# EAGLE design LMD18200_24 (EAGLE 7.7.0)
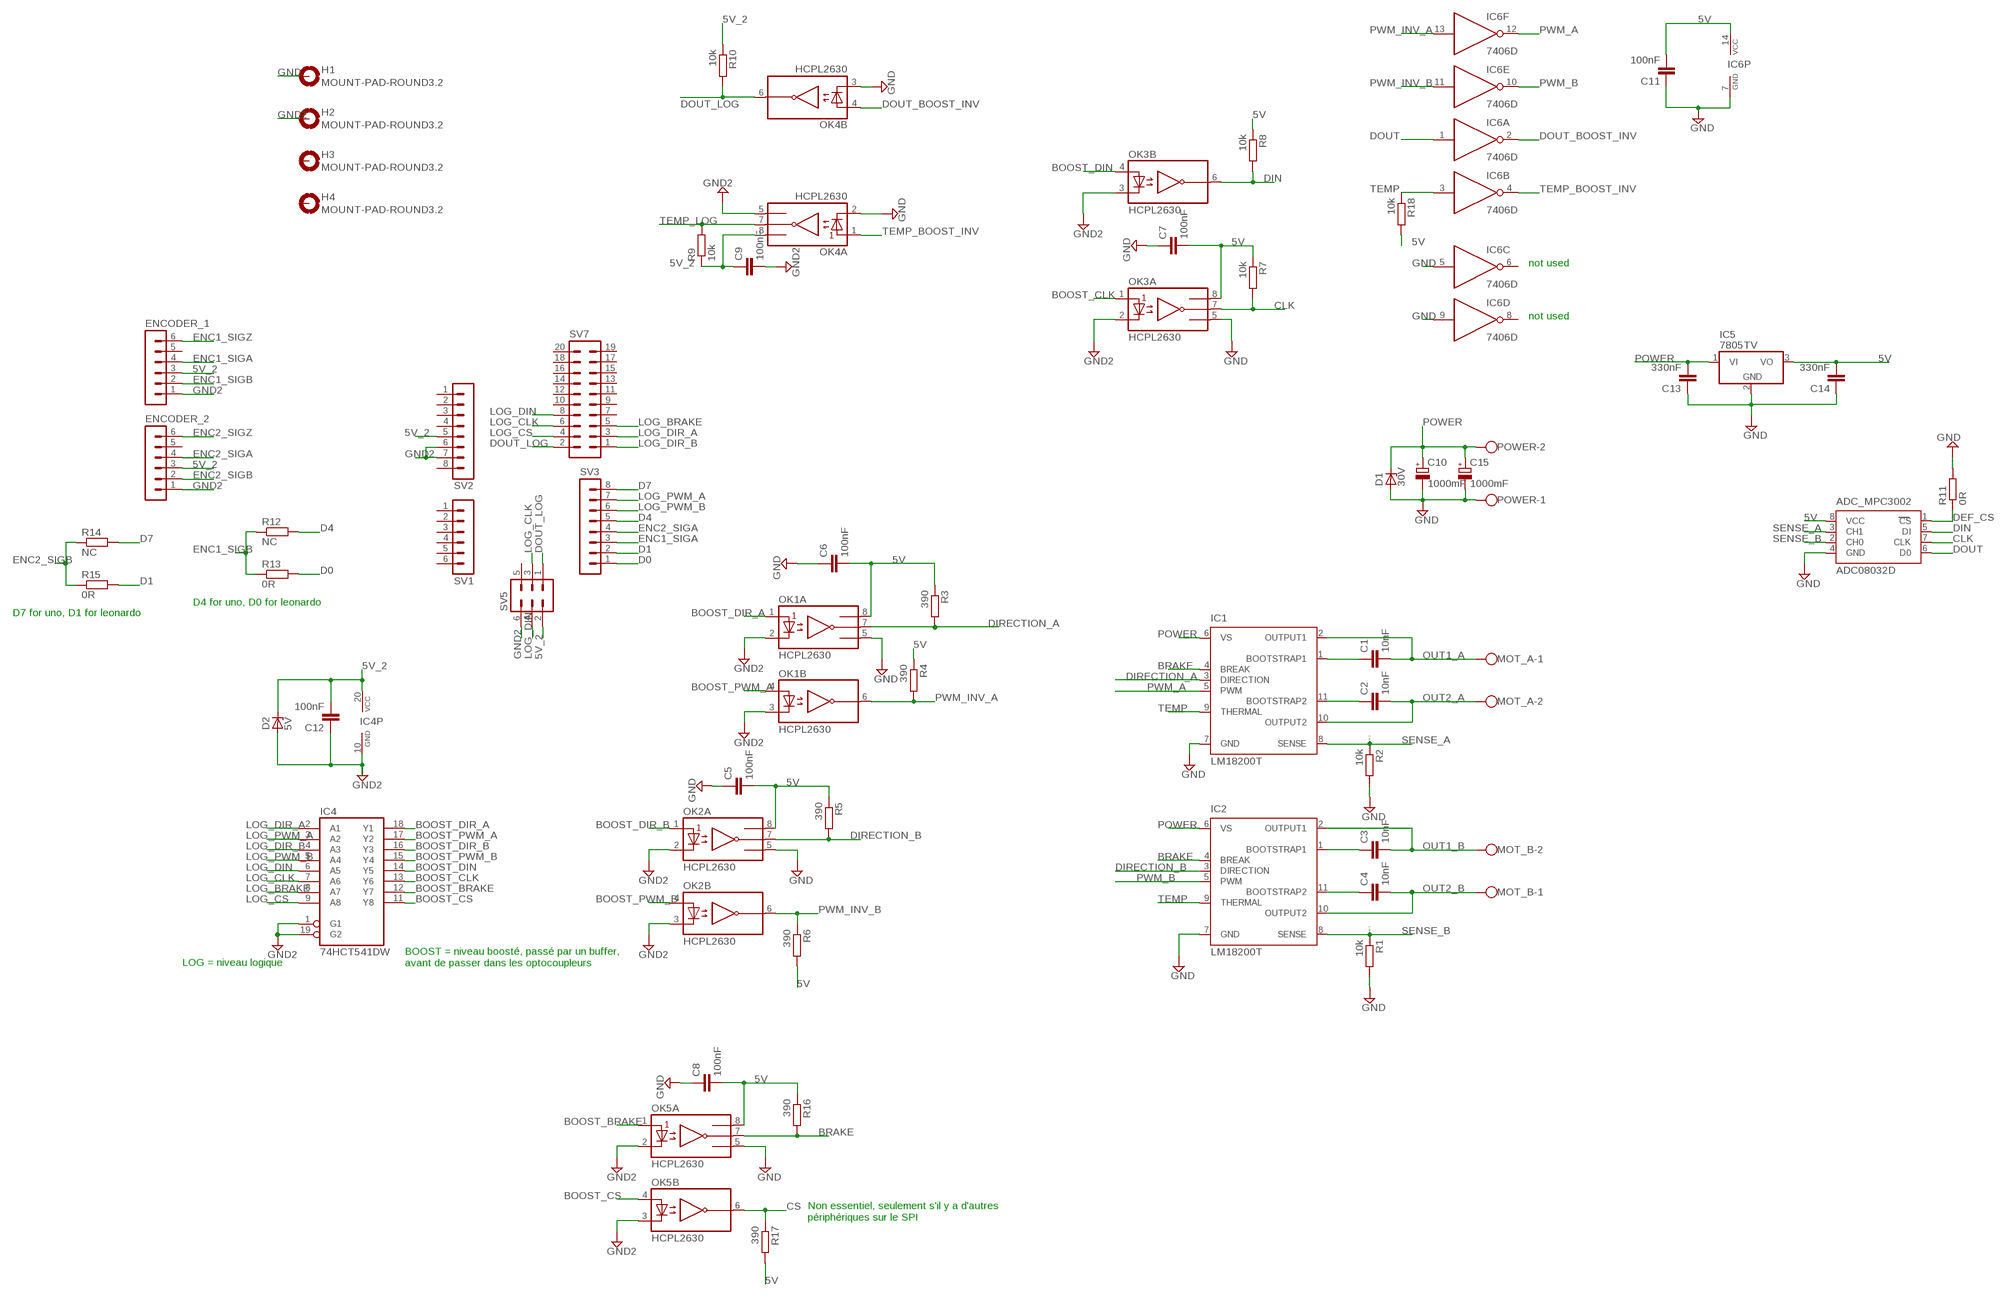
[diagram p0: schematic, sheet 1]

## Parts
ADC_MPC3002  ADC08032D  [SO08]
C1  10nF  C2.5/2  [C2.5-2]
C2  10nF  C2.5/2  [C2.5-2]
C3  10nF  C2.5/2  [C2.5-2]
C4  10nF  C2.5/2  [C2.5-2]
C5  100nF  C2.5/2  [C2.5-2]
C6  100nF  C2.5/2  [C2.5-2]
C7  100nF  C2.5/2  [C2.5-2]
C8  100nF  C2.5/2  [C2.5-2]
C9  100nF  C2.5/2  [C2.5-2]
C10  1000mF  CPOL-EUE5-13  [E5-13]
C11  100nF  C-EUC0805  [C0805]
C12  100nF  C2.5/2  [C2.5-2]
C13  330nF  C2.5/2  [C2.5-2]
C14  330nF  C2.5/2  [C2.5-2]
C15  1000mF  CPOL-EUE5-13  [E5-13]
D1  30V  ZENER-DIODESOD80C  [SOD80C]
D2  5V  ZENER-DIODESOD80C  [SOD80C]
ENCODER_1  MA06-1  [MA06-1]
ENCODER_2  MA06-1  [MA06-1]
H1  MOUNT-PAD-ROUND3.2  [3,2-PAD]
H2  MOUNT-PAD-ROUND3.2  [3,2-PAD]
H3  MOUNT-PAD-ROUND3.2  [3,2-PAD]
H4  MOUNT-PAD-ROUND3.2  [3,2-PAD]
IC1  LM18200T  [TO-220-11]
IC2  LM18200T  [TO-220-11]
IC4  74HCT541DW  [SO20W]
IC5  7805TV  [TO220V]
IC6  7406D  [SO14]
MOT_A  W237-102  [W237-102]
MOT_B  W237-102  [W237-102]
OK1  HCPL2630  [DIL08]
OK2  HCPL2630  [DIL08]
OK3  HCPL2630  [DIL08]
OK4  HCPL2630  [DIL08]
OK5  HCPL2630  [DIL08]
POWER  W237-102  [W237-102]
R1  10k  R  [R0805]
R2  10k  R  [R0805]
R3  390  R-EU_R0805  [R0805]
R4  390  R-EU_R0805  [R0805]
R5  390  R-EU_R0805  [R0805]
R6  390  R-EU_R0805  [R0805]
R7  10k  R-EU_R0805  [R0805]
R8  10k  R-EU_R0805  [R0805]
R9  10k  R-EU_R0805  [R0805]
R10  10k  R-EU_R0805  [R0805]
R11  0R  R  [R0805]
R12  NC  R-EU_R0805  [R0805]
R13  0R  R-EU_R0805  [R0805]
R14  NC  R-EU_R0805  [R0805]
R15  0R  R-EU_R0805  [R0805]
R16  390  R-EU_R0805  [R0805]
R17  390  R-EU_R0805  [R0805]
R18  10k  R-EU_R0805  [R0805]
SV1  MA06-1  [MA06-1]
SV2  MA08-1  [MA08-1]
SV3  MA08-1  [MA08-1]
SV5  MA03-2  [MA03-2]
SV7  MA10-2  [MA10-2]

## Nets
5V: ADC_MPC3002.8(VCC) C5.2 C6.2 C7.2 C8.2 C11.2 C14.2 IC5.3(VO) IC6.14(P:VCC) OK1.8(A:VCC) OK2.8(A:VCC) OK3.8(A:VCC) OK5.8(A:VCC) R3.1 R4.1 R5.1 R6.2 R7.1 R8.1 R16.1 R17.2 R18.2
5V_2: C9.1 C12.2 D2.C ENCODER_1.3 ENCODER_2.3 IC4.20(VCC) OK4.8(A:VCC) R9.1 R10.1 SV2.5 SV5.2
BOOST_BRAKE: IC4.12(Y7) OK5.1(A:A1)
BOOST_CLK: IC4.13(Y6) OK3.1(A:A1)
BOOST_CS: IC4.11(Y8) OK5.4(B:A2)
BOOST_DIN: IC4.14(Y5) OK3.4(B:A2)
BOOST_DIR_A: IC4.18(Y1) OK1.1(A:A1)
BOOST_DIR_B: IC4.16(Y3) OK2.1(A:A1)
BOOST_PWM_A: IC4.17(Y2) OK1.4(B:A2)
BOOST_PWM_B: IC4.15(Y4) OK2.4(B:A2)
BRAKE: IC1.4(BREAK) IC2.4(BREAK) OK5.7(A:VO1) R16.2
CLK: ADC_MPC3002.7(CLK) OK3.7(A:VO1) R7.2
CS: OK5.6(B:VO2) R17.1
D0: R13.2 SV3.1
D1: R15.2 SV3.2
D4: R12.2 SV3.5
D7: R14.2 SV3.8
DEF_CS: ADC_MPC3002.1(CS) R11.1
DIN: ADC_MPC3002.5(DI) OK3.6(B:VO2) R8.2
DIRECTION_A: IC1.3(DIRECTION) OK1.7(A:VO1) R3.2
DIRECTION_B: IC2.3(DIRECTION) OK2.7(A:VO1) R5.2
DOUT: ADC_MPC3002.6(D0) IC6.1(A:I)
DOUT_BOOST_INV: IC6.2(A:O) OK4.4(B:A2)
DOUT_LOG: OK4.6(B:VO2) R10.2 SV5.1 SV7.2
ENC1_SIGA: ENCODER_1.4 SV3.3
ENC1_SIGB: ENCODER_1.2 R12.1 R13.1
ENC1_SIGZ: ENCODER_1.6
ENC2_SIGA: ENCODER_2.4 SV3.4
ENC2_SIGB: ENCODER_2.2 R14.1 R15.1
ENC2_SIGZ: ENCODER_2.6
GND: ADC_MPC3002.4(GND) C5.1 C6.1 C7.1 C8.1 C10.- C11.1 C13.1 C14.1 C15.- D1.A H1.B3,2(MOUNT) IC1.7(GND) IC2.7(GND) IC5.2(GND) IC6.5(C:I) IC6.7(P:GND) IC6.9(D:I) OK1.5(A:GND) OK2.5(A:GND) OK3.5(A:GND) OK4.2(A:C1) OK4.3(B:C2) OK5.5(A:GND) POWER.1 R1.2 R2.2 R11.2
GND2: C9.2 C12.1 D2.A ENCODER_1.1 ENCODER_2.1 H2.B3,2(MOUNT) IC4.1(G1) IC4.10(GND) IC4.19(G2) OK1.2(A:C1) OK1.3(B:C2) OK2.2(A:C1) OK2.3(B:C2) OK3.2(A:C1) OK3.3(B:C2) OK4.5(A:GND) OK5.2(A:C1) OK5.3(B:C2) SV2.6 SV2.7 SV5.6
LOG_BRAKE: IC4.8(A7) SV7.5
LOG_CLK: IC4.7(A6) SV5.3 SV7.6
LOG_CS: IC4.9(A8) SV7.4
LOG_DIN: IC4.6(A5) SV5.4 SV7.8
LOG_DIR_A: IC4.2(A1) SV7.3
LOG_DIR_B: IC4.4(A3) SV7.1
LOG_PWM_A: IC4.3(A2) SV3.7
LOG_PWM_B: IC4.5(A4) SV3.6
N$4: C1.1 IC1.1(BOOTSTRAP1)
N$8: C2.1 IC1.11(BOOTSTRAP2)
N$9: C3.1 IC2.1(BOOTSTRAP1)
N$10: C4.1 IC2.11(BOOTSTRAP2)
OUT1_A: C1.2 IC1.2(OUTPUT1) MOT_A.1
OUT1_B: C3.2 IC2.2(OUTPUT1) MOT_B.2
OUT2_A: C2.2 IC1.10(OUTPUT2) MOT_A.2
OUT2_B: C4.2 IC2.10(OUTPUT2) MOT_B.1
POWER: C10.+ C13.2 C15.+ D1.C IC1.6(VS) IC2.6(VS) IC5.1(VI) POWER.2
PWM_A: IC1.5(PWM) IC6.12(F:O)
PWM_B: IC2.5(PWM) IC6.10(E:O)
PWM_INV_A: IC6.13(F:I) OK1.6(B:VO2) R4.2
PWM_INV_B: IC6.11(E:I) OK2.6(B:VO2) R6.1
SENSE_A: ADC_MPC3002.3(CH1) IC1.8(SENSE) R2.1
SENSE_B: ADC_MPC3002.2(CH0) IC2.8(SENSE) R1.1
TEMP: IC1.9(THERMAL) IC2.9(THERMAL) IC6.3(B:I) R18.1
TEMP_BOOST_INV: IC6.4(B:O) OK4.1(A:A1)
TEMP_LOG: OK4.7(A:VO1) R9.2
Unconnected: ENCODER_1.5 ENCODER_2.5 H3.B3,2(MOUNT) H4.B3,2(MOUNT) IC6.6(C:O) IC6.8(D:O) SV1.1 SV1.2 SV1.3 SV1.4 SV1.5 SV1.6 SV2.1 SV2.2 SV2.3 SV2.4 SV2.8 SV5.5 SV7.7 SV7.9 SV7.10 SV7.11 SV7.12 SV7.13 SV7.14 SV7.15 SV7.16 SV7.17 SV7.18 SV7.19 SV7.20

## Notes on the sheet
- not used
- not used
- D4 for uno, D0 for leonardo
- D7 for uno, D1 for leonardo
- LOG = niveau logique
- BOOST = niveau boosté, passé par un buffer, 
  avant de passer dans les optocoupleurs
- Non essentiel, seulement s'il y a d'autres 
  périphériques sur le SPI

## Library data of the parts
ADC_MPC3002 = linear:ADC08032: A/D CONVERTER
C1-C9 C12-C14 = capacitor-wima:C: CAPACITOR naming: grid - package width
C10 C15 = resistor:CPOL-EU: POLARIZED CAPACITOR, European symbol
C11 = resistor:C-EU: CAPACITOR, European symbol
D1 D2 = diode:ZENER-DIODE: Z-Diode
ENCODER_1 ENCODER_2 SV1 = con-lstb:MA06-1: PIN HEADER; OC_FARNELL: unknown; OC_NEWARK: unknown
H1-H4 = holes:MOUNT-PAD-ROUND: MOUNTING PAD, round
IC1 IC2 = national-semiconductor:LM18200T: 3A, 55V H-Bridge Motor Control SourcE: http://cache.national.com/ds/LM/LMD18200.pdf; OC_FARNELL: unknown; OC_NEWARK: unknown
IC4 = 74xx-eu:74*541: Octal BUFFER and LINE DRIVER, 3-state
IC5 = linear:78*: Positive VOLTAGE REGULATOR Source: http://cache.national.com/ds/LM/LM78L05.pdf http://www.fairchildsemi.com/ds/LM/LM7805.pdf
IC6 = 74xx-eu:74*06: Hex INVERTER, open collector high-voltage output
MOT_A MOT_B POWER = con-wago-500:W237-102: WAGO SCREW CLAMP; MPN: 237-102; OC_FARNELL: unknown; OC_NEWARK: 70K9898
OK1-OK5 = optocoupler:HCPL2630: HEWLETT PACKARD OPTO COUPLER; MF: AGILENT TECHNOLOGIES; MPN: HCPL-2630-000E; OC_FARNELL: 9994904; OC_NEWARK: 88H7813
R1 R2 R11 = eagle-ltspice:R: RESISTOR, European symbol; SPICEMODEL: NONE; SPICEPREFIX: R
R3-R10 R12-R18 = rcl:R-EU_: RESISTOR, European symbol
SV2 SV3 = con-lstb:MA08-1: PIN HEADER; OC_FARNELL: unknown; OC_NEWARK: unknown
SV5 = con-lstb:MA03-2: PIN HEADER; OC_FARNELL: unknown; OC_NEWARK: unknown
SV7 = con-lstb:MA10-2: PIN HEADER; OC_FARNELL: unknown; OC_NEWARK: unknown

## Board
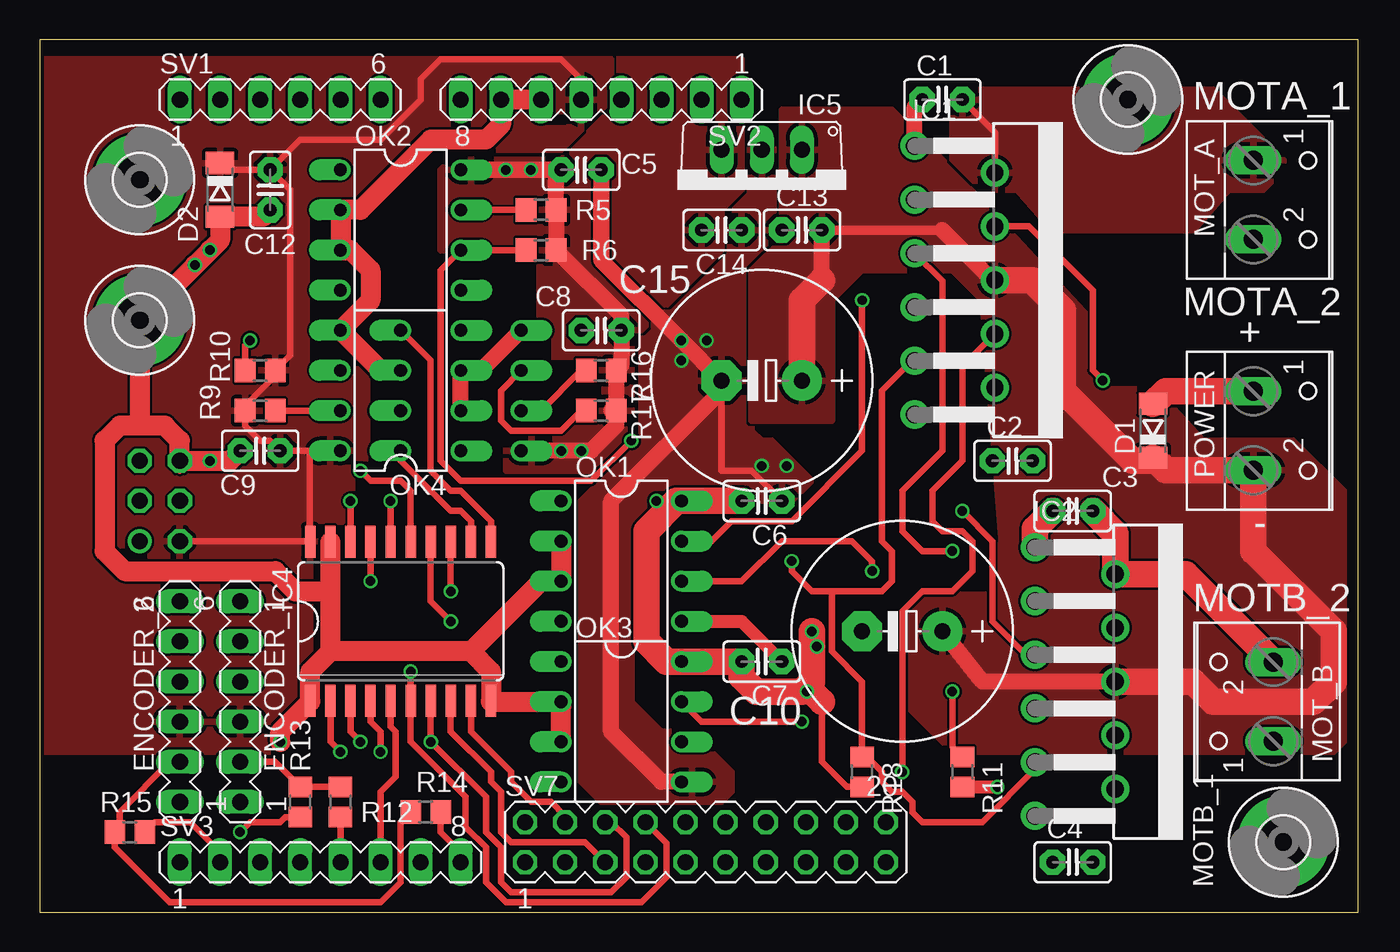
[diagram p1: board, top side]
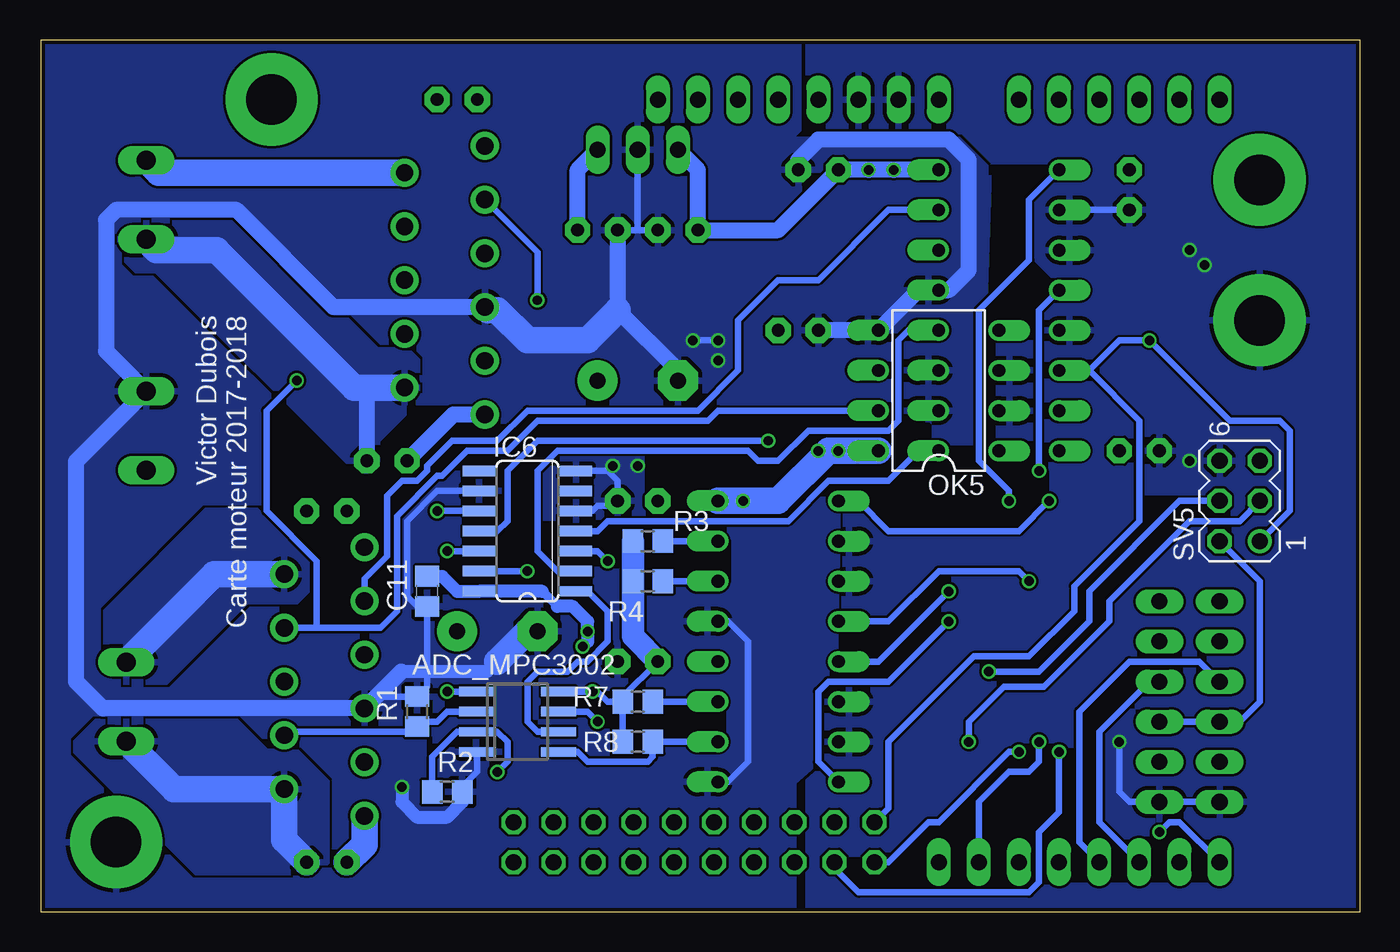
[diagram p2: board, bottom side, seen from below]

Size 83.49 x 55.23 mm. Coordinates in mm from the lower left corner, seen from the top.
Outline: 0,0 83.49,0 83.49,55.23 0,55.23 0,0
Copper layers (1*16): Top 0.035mm / dielectric 1.5mm / Bottom 0.035mm
Design rules "SeeedStudio_2layer_DRU_no_angle_20140221": minimum track width 6mil, minimum drill 12mil, track to track 6mil, track to pad 6mil, pad to pad 6mil, via to via 6mil, smd to smd 0mil, copper to edge 10mil, drill to drill 10mil, minimum pad ring 10mil, minimum via ring 6mil, stop-mask expansion 2mil, vias tented up to drill 100mil, thermal gap 10mil
tRestrict: area 58.1,20.3 to 60,20.6; area 67.6,33.3 to 70.5,34; area 45.1,49.5 to 46.4,50.2; area 23.2,37.1 to 25.1,37.5; area 23.2,29.5 to 24.4,29.8; area 20,26.7 to 20.3,27.6; area 21,29.5 to 21.6,34; area 17.1,34.6 to 17.8,44.1; area 32.1,49.8 to 33.3,50.5; area 32.1,34.9 to 32.4,36.5; area 32.4,34.6 to 34,34.9; area 35.2,32.4 to 35.6,34; 1 more areas
bRestrict: area 40.3,10.8 to 40.6,13.3; area 40,21 to 40.3,23.5; area 44.5,26 to 45.1,28.9; area 27.3,29.5 to 27.6,30.8; area 57.5,31.4 to 60.3,32.1; area 50.5,24.4 to 52.1,24.8; area 46,15.2 to 47.9,16.5; area 58.7,9.8 to 59.1,11.1; area 24.1,29.2 to 26.4,29.5; area 31.4,2.9 to 32.7,3.5; area 11.7,26 to 13.7,26.4; area 19.7,26 to 20.3,27.9; 3 more areas

### Footprints (pad centres in the part's own frame; a part is rotated, then mirrored left to right if it is on the bottom)
SO08 = smd 0.6 x 2.2: 1 -1.905,-2.6; 2 -0.635,-2.6; 3 0.635,-2.6; 4 1.905,-2.6; 5 1.905,2.6; 6 0.635,2.6; 7 -0.635,2.6; 8 -1.905,2.6
C2.5-2 = drill 0.813 pad 1.6 octagon: 1 -1.27,0; 2 1.27,0
E5-13 = drill 1.016 pad 2.54: + -2.54,0 | drill 1.016 pad 2.54 octagon: - 2.54,0
C0805 = smd 1.3 x 1.5: 1 -0.95,0; 2 0.95,0
SOD80C = smd 1.4 x 1.8: A 1.7,0; C -1.7,0
MA06-1 = drill 1.016 long: 1 -6.35,0; 2 -3.81,0; 3 -1.27,0; 4 1.27,0; 5 3.81,0; 6 6.35,0
3,2-PAD = drill 3.2 pad 5.842: B3,2 0,0
TO-220-11 = drill 1.1 pad 1.778: 1 -8.5,-9.37; 2 -6.8,-4.29; 3 -5.1,-9.37; 4 -3.4,-4.29; 5 -1.7,-9.37; 6 0,-4.29; 7 1.7,-9.37; 8 3.4,-4.29; 9 5.1,-9.37; 10 6.8,-4.29; 11 8.5,-9.37
SO20W = smd 0.66 x 2.032: 1 -5.715,-5.029; 2 -4.445,-5.029; 3 -3.175,-5.029; 4 -1.905,-5.029; 5 -0.635,-5.029; 6 0.635,-5.029; 7 1.905,-5.029; 8 3.175,-5.029; 9 4.445,-5.029; 10 5.715,-5.029; 11 5.715,5.029; 12 4.445,5.029; 13 3.175,5.029; 14 1.905,5.029; 15 0.635,5.029; 16 -0.635,5.029; 17 -1.905,5.029; 18 -3.175,5.029; 19 -4.445,5.029; 20 -5.715,5.029
TO220V = drill 1.016 long: 1 -2.54,-2.54; 2 0,-2.54; 3 2.54,-2.54
SO14 = smd 0.66 x 2.032: 1 -3.81,-3.073; 2 -2.54,-3.073; 3 -1.27,-3.073; 4 0,-3.073; 5 1.27,-3.073; 6 2.54,-3.073; 7 3.81,-3.073; 8 3.81,3.073; 9 2.54,3.073; 10 1.27,3.073; 11 0,3.073; 12 -1.27,3.073; 13 -2.54,3.073; 14 -3.81,3.073
W237-102 = drill 1.194 long: 1 -2.5,-1.27; 2 2.5,-1.27
DIL08 = drill 0.813 offset: 1 -3.81,-3.81; 2 -1.27,-3.81; 3 1.27,-3.81; 4 3.81,-3.81; 5 3.81,3.81; 6 1.27,3.81; 7 -1.27,3.81; 8 -3.81,3.81
R0805 = smd 1.3 x 1.5: 1 -0.95,0; 2 0.95,0
MA08-1 = drill 1.016 long: 1 -8.89,0; 2 -6.35,0; 3 -3.81,0; 4 -1.27,0; 5 1.27,0; 6 3.81,0; 7 6.35,0; 8 8.89,0
MA03-2 = drill 1.016: 1 -2.54,-1.27 | drill 1.016 octagon: 2 -2.54,1.27; 3 0,-1.27; 4 0,1.27; 5 2.54,-1.27; 6 2.54,1.27
MA10-2 = drill 1.016 octagon: 1 -11.43,-1.27; 2 -11.43,1.27; 3 -8.89,-1.27; 4 -8.89,1.27; 5 -6.35,-1.27; 6 -6.35,1.27; 7 -3.81,-1.27; 8 -3.81,1.27; 9 -1.27,-1.27; 10 -1.27,1.27; 11 1.27,-1.27; 12 1.27,1.27; 13 3.81,-1.27; 14 3.81,1.27; 15 6.35,-1.27; 16 6.35,1.27; 17 8.89,-1.27; 18 8.89,1.27; 19 11.43,-1.27; 20 11.43,1.27

### Placement (x,y rotation side)
ADC_MPC3002  53.34,12.06 270 bottom
C1  57.15,51.43 0 top
C2  61.59,28.58 0 top
C3  65.41,25.4 0 top
C4  65.41,3.17 0 top
C5  34.29,46.99 180 top
C6  45.72,26.04 180 top
C7  45.72,15.88 180 top
C8  35.56,36.83 0 top
C9  13.97,29.21 180 top
C10  54.61,17.78 180 top
C11  59.05,20.32 90 bottom
C12  14.61,45.72 90 top
C13  48.26,43.18 0 top
C14  43.18,43.18 180 top
C15  45.72,33.66 180 top
D1  70.48,30.48 90 top
D2  11.43,45.72 270 top
ENCODER_1  12.7,13.33 90 top
ENCODER_2  8.89,13.33 90 top
H1  78.74,4.45 0 top
H2  6.35,37.46 0 top
H3  6.35,46.35 0 top
H4  68.9,51.43 0 top
IC1  64.77,40 270 top
IC2  72.39,14.61 270 top
IC4  22.86,18.42 0 top
IC5  45.72,45.72 180 top
IC6  52.7,24.13 90 bottom
MOT_A  78.11,45.09 270 top
MOT_B  76.83,13.33 90 top
OK1  36.83,22.23 270 top
OK2  22.86,43.18 270 top
OK3  36.83,12.06 270 top
OK4  22.86,33.02 90 top
OK5  26.67,33.02 90 bottom
POWER  78.11,30.48 270 top
R1  59.69,12.7 90 bottom
R2  57.78,7.62 0 bottom
R3  45.09,23.5 0 bottom
R4  45.09,20.96 0 bottom
R5  31.75,44.45 180 top
R6  31.75,41.91 0 top
R7  45.72,13.33 0 bottom
R8  45.72,10.79 0 bottom
R9  13.97,31.75 0 top
R10  13.97,34.29 180 top
R11  58.42,8.89 270 top
R12  19.05,6.98 270 top
R13  16.51,6.98 270 top
R14  24.45,6.35 0 top
R15  5.71,5.08 0 top
R16  35.56,34.29 180 top
R17  35.56,31.75 0 top
R18  52.07,8.89 270 top
SV1  15.24,51.43 0 top
SV2  35.56,51.43 180 top
SV3  17.78,3.17 0 top
SV5  7.62,26.04 90 bottom
SV7  42.16,4.45 0 top

### Tracks (layer width: path | path; a pad name or v marks a point on that pad's centre or on a via)
5V  (via drill 0.6)
  Top 0.406: R18.2 51.12,7.94 49.53,9.53 49.53,13.33
  Top 1.016: C5.2 v31.11,46.99 | v31.11,46.99 v29.53,46.99 | v29.53,46.99 OK2.8 v29.53,46.99 | v29.53,46.99 v31.11,46.99 | v31.11,46.99 32.38,46.99 32.7,46.67 R5.1 R6.2 36.83,37.78 C8.2 36.83,34.61 R16.1 R17.2 | R17.2 36.2,31.75 | OK5.8 v33.02,29.21 v34.29,29.21 34.92,29.21 36.51,30.8 R17.2
  Top 1.676: C6.2 OK1.8 40.32,26.04 38.42,24.13 38.42,17.15 39.69,15.88 OK3.8 C7.2 44.45,14.92 45.4,13.97 48.26,13.97 48.58,14.29 | v48.9,17.78 48.9,14.61 48.58,14.29 | 49.53,13.33 48.58,14.29
  Bottom 0.406: R8.1 R7.1 | 44.45,16.51 C7.2 46.67,13.65 R7.1 | 58.74,20.96 C11.2 | R7.1 47.62,13.33 48.26,13.97 v48.58,13.97 ADC_MPC3002.8
  Bottom 0.61: 50.8,19.37 51.75,20.32
  Bottom 0.813: 50.8,19.37 49.85,19.37 48.9,18.42 v48.9,17.78 48.9,17.15 v49.21,16.83 | 51.75,20.32 IC6.14 57.15,20.32 58.1,21.27 C11.2
  Bottom 1.016: OK2.8 v29.53,46.99 v31.11,46.99 C5.2 36.83,43.18 C14.2 41.91,46.99 IC5.3
  Bottom 1.422: R4.1 R3.1 46.03,17.46 C7.2
  Bottom 1.676: OK5.8 v33.02,29.21 33.66,29.21 36.83,26.04 v39.05,26.04 OK1.8
  pour Top (rank 3): 25.4,46.99 26.04,47.62 33.02,47.62 36.2,50.8 36.2,53.98 44.45,53.98 44.45,45.72 43.18,44.45 43.18,41.91 37.47,36.2 37.47,30.48 34.92,27.94 29.53,27.94 29.53,30.48 29.84,41.91 25.4,41.91
5V_2
  Top 0.406: IC4.20 17.09,23.5 | 17.09,23.5 SV5.2 | 17.14,29.21 C9.1 14.61,29.85 13.97,29.85 13.02,30.8 R9.1 13.02,32.07 14.61,33.66 14.61,33.98 R10.1 15.88,35.24 15.88,45.72 C12.2 | 17.14,29.21 OK4.8 | SV2.5 34.29,52.7 33.02,53.98 25.4,53.98 24.13,52.7 24.13,51.43 21.59,48.89 16.51,48.89 C12.2 | 17.09,23.5 17.09,29.16 17.14,29.21 | C12.2 11.86,46.99 D2.C
  Bottom 0.406: ENCODER_1.3 ENCODER_2.3 7.62,12.06 6.35,13.33 6.35,20.96 SV5.2
  pour Top: -0.64,53.98 36.2,53.98 36.2,51.43 33.02,48.26 26.04,48.26 24.77,46.99 24.77,23.5 17.14,23.5 17.14,10.16 -0.64,10.16
BOOST_BRAKE
  Top 0.406: IC4.12 27.3,24.77 26.67,25.4 26.04,25.4 22.86,28.58 OK5.1
BOOST_CLK  (via drill 0.6 pad 0.81)
  Top 0.406: IC4.13 v26.04,20.32
  Bottom 0.406: v26.04,20.32 30.48,15.88 OK3.1
BOOST_CS
  Top 0.406: IC4.11 28.57,24.77 26.67,26.67 26.04,26.67 24.77,27.94 24.77,34.92 OK5.4
BOOST_DIN  (via drill 0.6 pad 0.81)
  Top 0.406: IC4.14 24.77,19.69 v26.04,18.42
  Bottom 0.406: v26.04,18.42 29.84,14.61 33.66,14.61 34.29,13.97 34.29,9.53 OK3.4
BOOST_DIR_A  (via drill 0.6)
  Top 0.406: v19.68,26.04 IC4.18
  Bottom 0.406: OK1.1 31.75,26.04 29.84,24.13 21.59,24.13 v19.68,26.04
BOOST_DIR_B  (via drill 0.6)
  Top 0.406: IC4.16 v22.23,26.04
  Bottom 0.406: OK2.1 20.95,45.09 20.95,41.27 24.13,38.1 24.13,28.58 22.23,26.67 v22.23,26.04
BOOST_PWM_A  (via drill 0.6 pad 0.81)
  Top 0.406: IC4.17 v20.95,20.96
  Bottom 0.406: v20.95,20.96 21.59,21.59 26.67,21.59 29.84,18.42 OK1.4
BOOST_PWM_B  (via drill 0.6)
  Top 0.406: v20.32,27.94 20.95,27.31 22.86,27.31 23.5,26.67 IC4.15
  Bottom 0.406: v20.32,27.94 20.32,38.1 OK2.4
BRAKE  (via drill 0.6)
  Top 0.406: OK5.7 31.75,31.75 34.29,34.29 R16.2 | IC1.4 62.64,43.41 66.67,39.37 66.67,34.29 v67.31,33.66
  Bottom 0.406: 67.88,17.78 IC2.4 66.04,18.01 | OK5.7 40.64,31.75 41.27,31.12 52.07,31.12 53.98,29.21 56.52,29.21 58.1,27.62 58.42,27.62 60.96,25.08 60.96,19.05 62.01,18.01 66.04,18.01 | v67.31,33.66 69.22,31.75 69.22,25.4 66.04,22.23 66.04,18.01
CLK  (via drill 0.6)
  Top 0.406: v48.26,12.06 41.91,12.06 OK3.7
  Bottom 0.406: OK3.7 R7.2 | ADC_MPC3002.7 48.9,12.7 v48.26,12.06
CS
  Top 0.406: R17.1 34.29,31.75 33.02,30.48 29.84,30.48 29.21,31.12 29.21,33.02 OK5.6
D0  (via drill 0.6 pad 0.81)
  Top 0.406: R13.2 15.56,6.04 15.24,5.71 13.34,5.71 v12.7,5.08
  Bottom 0.406: SV3.1 11.43,5.71 12.06,5.71 v12.7,5.08
D1
  Top 0.406: SV3.2 11.43,3.81 9.53,5.71 7.3,5.71 R15.2
D4
  Top 0.406: SV3.5 R12.2
D7
  Top 0.406: SV3.8 26.67,3.81 25.4,5.08 R14.2
DEF_CS  (via drill 0.6)
  Top 0.406: v57.78,13.97 57.78,10.47 R11.1
  Bottom 0.406: ADC_MPC3002.1 v57.78,13.97
DIN
  Bottom 0.406: OK3.6 R8.2 44.77,9.84 45.09,9.53 48.9,9.53 49.53,10.16 ADC_MPC3002.5
DIRECTION_A  (via drill 0.6)
  Top 0.406: OK1.7 42.55,23.5 43.81,24.77 47.62,24.77 52.07,29.21 v52.07,38.73
  Bottom 0.406: R3.2 OK1.7 | v52.07,38.73 52.07,41.77 IC1.3
DIRECTION_B
  Top 0.406: OK2.7 R5.2
  Bottom 0.406: OK2.7 29.84,44.45 34.29,40 36.83,40 39.37,37.46 39.37,34.29 41.91,31.75 52.7,31.75 54.61,29.85 57.47,29.85 59.05,28.26 59.05,27.94 59.69,27.31 60.64,27.31 61.59,26.35 61.59,22.54 63.02,21.12 IC2.3 63,19.69 63,20.19
DOUT
  Bottom 0.406: ADC_MPC3002.6 52.07,11.43 52.7,12.06 52.7,14.61 52.07,15.24 50.16,15.24 49.53,15.88 48.9,15.88 47.62,17.15 47.62,19.05 48.9,20.32 IC6.1 49.53,20.22
DOUT_BOOST_INV
  Bottom 0.406: IC6.2 50.8,21.59 52.07,22.86 52.07,27.94 50.8,29.21 38.73,29.21 38.1,28.58 36.83,28.58 34.92,30.48 29.84,30.48 29.21,31.12 29.21,36.2 28.57,36.83 OK4.4
DOUT_LOG  (via drill 0.6 pad 0.81)
  Top 0.406: v13.34,36.2 13.02,35.88 R10.2
  Bottom 0.406: SV5.1 4.45,25.4 4.45,30.48 5.08,31.12 8.26,31.12 v13.34,36.2 15.24,36.2 17.14,34.29 | SV7.2 29.84,6.6 29.84,10.79 24.45,16.19 20.95,16.19 18.1,19.05 18.1,20.64 13.97,24.77 13.97,31.12 17.14,34.29 | OK4.6 17.14,34.29
ENC1_SIGA
  Bottom 0.406: ENCODER_1.4 13.34,14.61 16.51,11.43 16.51,5.71 SV3.3
ENC1_SIGB
  Top 0.406: R12.1 R13.1 14.92,9.53 ENCODER_1.2
ENC2_SIGA
  Bottom 0.406: 16.51,1.91 SV3.4 17.78,4.45 17.78,12.7 14.61,15.88 10.16,15.88 ENCODER_2.4
ENC2_SIGB
  Top 0.406: ENCODER_2.2 8.26,9.53 5.08,6.35 5.08,5.39 R15.1 4.76,4.12 8.26,0.64 21.59,0.64 22.86,1.91 22.86,5.71 R14.1
GND  (via drill 0.6)
  Top 0.406: C6.1 45.09,27.94 43.18,27.94 43.18,33.02 C15.-
  Top 0.813: OK1.5 44.45,18.42 C7.1 | R11.2 v60.64,7.94
  Top 1.016: OK3.5 39.37,8.26 36.2,11.43 36.2,26.04 43.18,33.02 | C5.1 35.56,41.27 v40.64,36.2 C15.- | OK5.5 27.94,34.29 OK4.3 OK4.2
  Top 1.676: POWER.1 71.28,32.98 D1.A
  Bottom 0.406: IC6.7 47.62,27.94 46.99,27.31 C6.1 47.31,25.72 48.26,25.72 48.58,25.4 IC6.5 | R2.2 56.84,7.93 55.88,8.89 55.88,10.1 ADC_MPC3002.4 | C14.1 45.72,43.18 | 45.72,43.18 C13.1 | IC5.2 45.72,43.18 | 62.27,13.65 R1.2 59.05,14.29 C11.1 59.69,19.37 60.33,20 60.33,24.77 58.42,26.67 IC6.9 | OK1.5 40.01,18.42 38.73,17.15 38.73,9.53 40.01,8.26 OK3.5 | v40.64,36.2 v42.23,36.2
  Bottom 0.813: 54.61,15.88 55.24,15.24 60.69,15.24 | v60.64,7.94 60.64,6.98 59.69,6.03 57.78,6.03 56.83,6.98 R2.2
  Bottom 1.016: C15.- 43.18,34.29 46.99,38.1 C13.1 | 55.2,38.1 IC1.7 64.97,38.3 71.12,44.45 78.74,44.45 79.38,43.81 79.38,35.52 POWER.1 81.28,28.54 81.28,14.61 79.58,12.9 IC2.7 62.27,13.65 60.69,15.24 | C8.1 OK5.5 27.94,39.37 OK2.5 26.04,39.37 24.77,40.64 24.77,47.62 26.04,48.89 34.29,48.89 35.56,47.62 C5.1
  Bottom 1.676: C10.- 52.7,17.78 54.61,15.88 | 55.2,38.1 54.61,38.1 52.7,36.2 48.9,36.2 46.99,38.1
  other vias: 45.72,28.26 47.31,28.26 40.64,34.92
  pour Bottom (rank 5): 23.5,46.99 25.4,48.89 36.2,48.89 35.56,49.53 35.56,58.42 88.27,58.42 88.27,-4.45 35.88,-4.13 35.88,8.26 33.34,10.48 33.02,27.94 24.13,27.94
  pour Top (rank 5): 34.29,41.91 34.29,48.26 36.83,53.98 46.99,53.98 46.99,42.54 45.09,40.64 45.09,30.48 45.72,29.85 46.35,29.85 48.9,27.31 46.99,25.4 46.35,25.4 45.09,26.67 40.01,26.67 37.47,24.13 37.47,13.33 39.37,11.43 41.27,11.43 43.81,8.89 43.81,7.62 43.18,6.98 35.56,6.98 34.29,8.26 34.29,26.04 38.1,29.85 38.1,38.1
GND2  (via drill 0.6, 0.6 pad 0.81)
  Top 0.406: OK3.2 32.97,13.39 | 8.89,27.94 SV5.6 | 14.18,44.02 C12.1
  Top 1.27: SV2.6 SV2.7 29.21,49.85 28.26,48.89 24.77,48.89 20.32,44.45 OK2.2 OK2.3 19.68,41.91 20.95,40.64 20.95,38.73 OK4.5 21.59,34.29 OK5.3 | 14.18,44.02 D2.A 11.43,42.54 v10.79,41.91 v9.84,40.96 H2.B3,2 6.35,30.8 | C9.2 12.06,28.58 v10.79,28.58 SV5.6 8.89,29.85 7.94,30.8 6.35,30.8 | OK3.3 33.02,13.02 32.7,13.33 28.57,13.33 | OK1.2 OK1.3 31.75,20.96 27.3,16.51 | 27.3,16.51 18.41,16.51 | 18.41,16.51 18.41,20.32 | 18.41,20.32 IC4.19 | 27.3,16.51 28.57,15.24 IC4.10 | IC4.1 17.14,15.24 18.41,16.51 | v15.24,10.79 15.24,11.43 17.14,13.33 | 6.35,30.8 5.08,30.8 4.13,29.85 4.13,22.86 5.4,21.59 14.92,21.59 16.19,20.32 18.41,20.32
  Bottom 0.406: ENCODER_2.1 ENCODER_1.1 14.61,6.98 15.24,7.62 v15.24,10.79 | OK2.2 C12.1
  pour Bottom (rank 6): -7.62,58.42 -7.62,-3.17 -4.45,0 34.92,0 34.92,26.67 33.66,27.94 23.5,27.94 22.86,28.58 22.86,46.35 25.4,48.89 34.92,48.89 34.92,57.78 34.29,58.42
LOG_BRAKE
  Top 0.406: IC4.8 26.04,11.43 28.57,8.89 28.57,8.26 29.21,7.62 29.21,5.08 29.84,4.45 34.54,4.45 SV7.5
LOG_CLK  (via drill 0.6)
  Top 0.406: SV7.6 36.2,5.71 37.15,4.76 37.15,2.22 36.2,1.27 29.84,1.27 29.21,1.91 29.21,4.13 28.26,5.08 28.26,7.3 v24.77,10.79 IC4.7
  Bottom 0.406: SV5.3 7.62,24.77 10.79,24.77 15.88,19.69 15.88,18.42 20,14.29 22.54,14.29 24.77,12.06 v24.77,10.79
LOG_CS
  Top 0.406: IC4.9 27.3,11.43 29.84,8.89 29.84,8.26 31.11,6.98 32.38,6.98 33.27,6.1 SV7.4
LOG_DIN  (via drill 0.6 pad 0.81)
  Top 0.406: v23.5,15.24 IC4.6 23.5,10.79 26.99,7.3 26.99,5.4 28.26,4.13 28.26,1.91 29.53,0.64 38.1,0.64 39.69,2.22 39.69,4.38 SV7.8
  Bottom 0.406: SV5.4 11.43,26.04 17.14,20.32 17.14,18.42 20.32,15.24 v23.5,15.24 | 38.35,5.33 SV7.8
LOG_DIR_A  (via drill 0.6)
  Top 0.406: IC4.2 18.41,10.79 v19.05,10.16
  Bottom 0.406: SV7.3 33.27,2.79 31.75,1.27 20.95,1.27 20.32,1.91 20.32,5.08 19.05,6.35 v19.05,10.16
LOG_DIR_B  (via drill 0.6)
  Top 0.406: IC4.4 20.95,12.06 21.59,11.43 v21.59,10.16
  Bottom 0.406: SV7.1 29.84,3.17 27.3,5.71 26.67,5.71 22.23,10.16 v21.59,10.16
LOG_PWM_A  (via drill 0.6 pad 0.81)
  Top 0.406: IC4.3 19.68,11.43 v20.32,10.79
  Bottom 0.406: SV3.7 24.13,6.98 22.23,8.89 20.95,8.89 20.32,9.53 v20.32,10.79
LOG_PWM_B
  Top 0.406: IC4.5 22.23,11.75 22.54,11.43 22.54,8.57 21.59,7.62 SV3.6
N$4
  Top 1.016: IC1.1 55.4,50.95 C1.1
N$8
  Bottom 1.016: C2.1 57.4,31.51 IC1.11
N$9
  Top 1.676: IC2.1 63.02,24.29 C3.1
N$10
  Bottom 1.676: C4.1 63.02,4.29 IC2.11
OUT1_A
  Top 0.406: IC1.2 60.48,49.38 C1.2
  Bottom 1.676: IC1.2 76.06,46.8 MOT_A.1
  pour Top: 57.78,52.07 57.78,47.62 59.69,45.72 61.91,45.72 64.14,43.18 73.03,43.18 75.25,45.72 77.47,45.72 78.74,46.99 78.74,47.62 74.3,52.07
OUT1_B
  Top 1.676: 78.11,15.88 72.58,21.41 IC2.2 68.1,23.98 C3.2
  Bottom 1.676: IC2.2 72.53,21.41 MOT_B.2
  pour Bottom: 66.67,20.32 66.67,22.23 69.85,25.4 73.03,25.4 78.74,19.69 79.38,19.05 79.38,15.24 78.74,14.61 75.56,14.61 70.48,19.69 67.31,19.69
OUT2_A
  Bottom 1.016: C2.2 62.87,33.2
  Bottom 1.676: IC1.10 62.87,33.2 63.69,33.2 72.39,41.91 76.16,41.91 MOT_A.2
  pour Bottom: 62.23,28.58 62.23,29.85 60.33,31.75 59.69,32.38 59.69,34.92 60.33,35.56 62.23,35.56 70.48,43.81 77.47,43.81 78.74,42.54 78.74,41.91 77.47,40.64 76.2,40.64 63.5,27.94 62.87,27.94
OUT2_B
  Bottom 1.676: MOT_B.1 75.08,7.8 IC2.10 68.1,4.6 C4.2
  pour Bottom: 66.04,2.54 65.41,3.17 65.41,8.26 67.31,10.16 69.22,10.16 71.75,12.7 79.38,12.7 81.28,10.79 81.28,10.16 73.66,2.54
POWER
  Top 0.61: 57.15,43.18 C13.2
  Top 1.016: IC2.6 59.69,14.61 C10.+ | 49.53,40 C13.2 | IC1.6 60.33,40 57.15,43.18
  Top 1.676: IC2.6 73.03,14.61 74.3,13.33 80.64,13.33 81.92,14.61 81.92,17.78 76.83,22.86 POWER.2 71.28,27.98 D1.C 70.28,28.58 69.22,28.58 64.77,33.02 64.77,38.1 62.87,40 IC1.6 | C15.+ 48.26,38.73 49.53,40
  Bottom 1.016: C13.2 49.53,46.99 IC5.1
  pour Top (rank 4): 45.09,31.12 45.09,40.64 46.99,42.54 46.99,50.8 53.98,50.8 57.78,46.99 73.66,29.85 60.96,22.86 59.69,38.73 57.78,40.64 52.07,40.64 50.16,38.73 50.16,31.12
  pour Top: 54.61,19.69 54.61,15.88 54.61,13.33 57.78,10.16 81.92,10.16 82.55,10.79 82.55,26.67 79.38,29.85 67.31,29.85 59.69,22.23 57.15,22.23
PWM_A  (via drill 0.6)
  Top 0.406: v57.78,22.86 55.88,22.86 54.61,24.13 54.61,26.67 57.15,29.21 57.15,39.95 IC1.5
  Bottom 0.406: IC1.5 55.45,41.7 | v57.78,22.86 IC6.12
PWM_B  (via drill 0.6)
  Top 0.406: IC2.5 62.44,16.3 60.33,18.42 60.33,23.5 v58.42,25.4
  Bottom 0.406: v58.42,25.4 IC6.10
PWM_INV_A  (via drill 0.6)
  Top 0.406: v52.7,21.59 52.7,22.23 51.44,23.5 46.99,23.5 44.45,20.96 OK1.6
  Bottom 0.406: v52.7,21.59 IC6.13 | R4.2 OK1.6
PWM_INV_B  (via drill 0.6)
  Top 0.406: R6.1 OK2.6 25.4,40.64 25.4,28.58 26.67,27.31 34.92,27.31 v37.47,29.85
  Bottom 0.406: IC6.11 54.61,24.13 53.98,24.77 53.98,27.94 52.07,29.85 v37.47,29.85
SENSE_A  (via drill 0.6)
  Top 0.406: 60.48,36.35 IC1.8 58.42,34.54 58.42,28.58 56.52,26.67 56.52,24.77 57.15,24.13 58.42,24.13 59.05,23.5 59.05,21.59 57.78,20.32 55.88,20.32 54.61,19.05 v54.61,8.89
  Bottom 0.406: R2.1 58.73,9.85 57.15,11.43 ADC_MPC3002.3 54.61,11.43 53.98,10.79 53.98,9.53 v54.61,8.89
SENSE_B
  Bottom 0.406: ADC_MPC3002.2 57.78,12.7 58.42,12.06 59.38,12.06 R1.1 60.01,11.75 60.33,11.43 67.88,11.43 IC2.8
TEMP  (via drill 0.6)
  Top 0.406: IC1.9 55.23,34.91 53.34,33.02 53.34,23.5 53.98,22.86 53.98,20.96 53.34,20.32 50.16,20.32 | 50.16,20.32 48.9,20.32 47.62,21.59 v47.62,22.23 | IC2.9 63.02,9.04 59.69,5.71 55.88,5.71 55.24,6.35 55.24,6.98 54.61,7.62 53.98,7.62 53.34,8.26 53.34,8.89 52.39,9.84 R18.1 52.07,14.61 50.16,16.51 50.16,20.32
  Bottom 0.406: IC6.3 48.26,22.86 v47.62,22.23
TEMP_BOOST_INV
  Bottom 0.406: IC6.4 48.26,24.13 47.62,24.77 36.2,24.77 33.66,27.31 29.84,27.31 27.94,29.21 OK4.1
TEMP_LOG
  Top 0.406: OK4.7 R9.2

### Text on the board
tNames: MOTA_1 | MOTA_2 | + | - | MOTB_2 | MOTB_1
bNames: Victor Dubois / Carte moteur 2017-2018